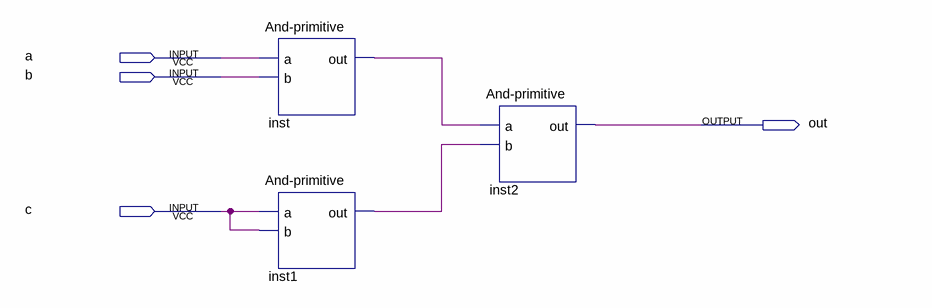
[diagram p0: schematic sheet]
// Quartus schematic And3-primitive.bdf as structural Verilog: 3 symbols, 4 pins
module \And3-primitive  (
  input  a,
  input  b,
  input  c,
  output out
);

  wire inst1_out, inst_out;

  \And-primitive  inst (.a(a), .b(b), .out(inst_out));
  \And-primitive  inst1 (.a(c), .b(c), .out(inst1_out));
  \And-primitive  inst2 (.a(inst_out), .b(inst1_out), .out(out));
endmodule
